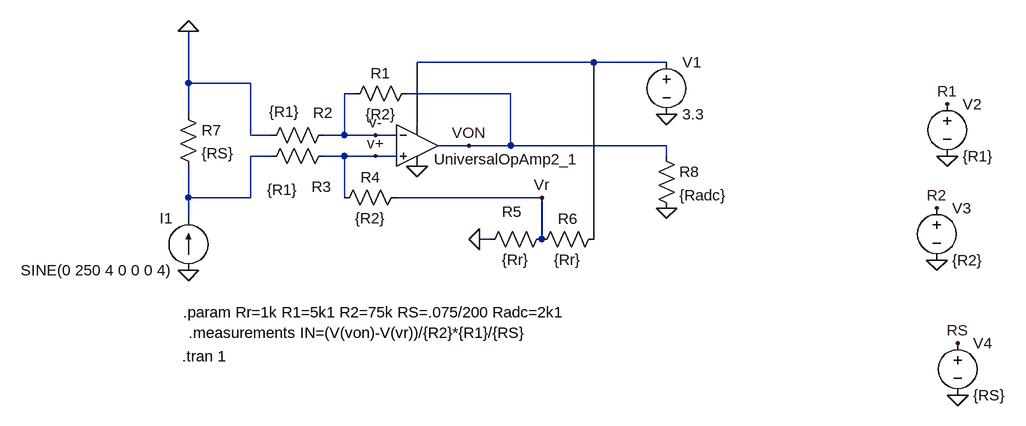
[diagram p0: schematic ib_filter_module.asc]
ib_filter_module.asc, the LTspice schematic file:
Version 4
SHEET 1 1480 704
WIRE 432 16 160 16
WIRE 544 16 432 16
WIRE -192 48 -192 -32
WIRE -96 48 -192 48
WIRE 64 64 48 64
WIRE 304 64 144 64
WIRE -192 96 -192 48
WIRE 160 112 160 16
WIRE -96 128 -96 48
WIRE -64 128 -96 128
WIRE 48 128 48 64
WIRE 48 128 16 128
WIRE 96 128 48 128
WIRE 128 128 96 128
WIRE 240 144 192 144
WIRE 304 144 304 64
WIRE 304 144 240 144
WIRE 544 144 304 144
WIRE -64 160 -96 160
WIRE 48 160 16 160
WIRE 96 160 48 160
WIRE 128 160 96 160
WIRE 544 160 544 144
WIRE -192 224 -192 176
WIRE -96 224 -96 160
WIRE -96 224 -192 224
WIRE 48 224 48 160
WIRE 352 224 128 224
WIRE -192 256 -192 224
WIRE 272 288 256 288
WIRE 352 288 352 224
WIRE 432 288 432 16
FLAG 160 176 0
FLAG 544 96 0
FLAG 256 288 0
FLAG -192 336 0
FLAG 96 128 v-
FLAG 96 160 v+
FLAG 240 144 VON
FLAG 544 240 0
FLAG 352 224 Vr
FLAG 976 160 0
FLAG 960 320 0
FLAG 992 528 0
FLAG 976 80 R1
FLAG 960 240 R2
FLAG 992 448 RS
FLAG -192 -32 0
SYMBOL voltage 544 0 R0
WINDOW 123 0 0 Left 0
WINDOW 39 0 0 Left 0
SYMATTR InstName V1
SYMATTR Value 3.3
SYMBOL res 160 48 R90
WINDOW 0 0 56 VBottom 2
WINDOW 3 32 56 VTop 2
SYMATTR InstName R1
SYMATTR Value {R2}
SYMBOL res 32 112 R90
WINDOW 0 -3 17 VBottom 2
WINDOW 3 -36 76 VTop 2
SYMATTR InstName R2
SYMATTR Value {R1}
SYMBOL res 32 144 R90
WINDOW 0 79 19 VBottom 2
WINDOW 3 52 79 VTop 2
SYMATTR InstName R3
SYMATTR Value {R1}
SYMBOL res 144 208 R90
WINDOW 0 0 56 VBottom 2
WINDOW 3 32 56 VTop 2
SYMATTR InstName R4
SYMATTR Value {R2}
SYMBOL res 368 272 R90
WINDOW 0 -11 62 VBottom 2
WINDOW 3 32 56 VTop 2
SYMATTR InstName R5
SYMATTR Value {Rr}
SYMBOL res 448 272 R90
WINDOW 0 0 56 VBottom 2
WINDOW 3 32 56 VTop 2
SYMATTR InstName R6
SYMATTR Value {Rr}
SYMBOL res -208 80 R0
SYMATTR InstName R7
SYMATTR Value {RS}
SYMBOL current -192 336 R180
WINDOW 0 24 80 Left 2
WINDOW 3 24 0 Left 2
WINDOW 123 0 0 Left 0
WINDOW 39 0 0 Left 0
SYMATTR InstName I1
SYMATTR Value SINE(0 250 4 0 0 0 4)
SYMBOL res 528 144 R0
SYMATTR InstName R8
SYMATTR Value {Radc}
SYMBOL OpAmps\\UniversalOpamp2 160 144 R0
WINDOW 0 26 21 Left 2
SYMATTR InstName UniversalOpAmp2_1
SYMBOL voltage 976 64 R0
WINDOW 123 0 0 Left 0
WINDOW 39 0 0 Left 0
SYMATTR InstName V2
SYMATTR Value {R1}
SYMBOL voltage 960 224 R0
WINDOW 123 0 0 Left 0
WINDOW 39 0 0 Left 0
SYMATTR InstName V3
SYMATTR Value {R2}
SYMBOL voltage 992 432 R0
WINDOW 123 0 0 Left 0
WINDOW 39 0 0 Left 0
SYMATTR InstName V4
SYMATTR Value {RS}
TEXT -200 400 Left 2 !.param Rr=1k R1=5k1 R2=75k RS=.075/200 Radc=2k1
TEXT -202 468 Left 2 !.tran 1
TEXT -192 432 Left 2 !.measurements IN=(V(von)-V(vr))/{R2}*{R1}/{RS}

The netlist it stands for:
* ib_filter_module.asc
V1 N001 0 3.3
R1 VON v- {R2}
R2 v- 0 {R1}
R3 v+ N002 {R1}
R4 Vr v+ {R2}
R5 Vr 0 {Rr}
R6 N001 Vr {Rr}
R7 0 N002 {RS}
I1 0 N002 SINE(0 250 4 0 0 0 4)
R8 VON 0 {Radc}
XUniversalOpAmp2_1 v+ v- N001 0 VON level.2 Avol=1Meg GBW=10Meg Slew=10Meg ilimit=25m rail=0 Vos=0 phimargin=45 en=0 enk=0 in=0 ink=0 Rin=500Meg  ; pins IN+ IN- V+ V- OUT
V2 R1 0 {R1}
V3 R2 0 {R2}
V4 RS 0 {RS}
.param Rr=1k R1=5k1 R2=75k RS=.075/200 Radc=2k1
.tran 1
.measurements IN=(V(von)-V(vr))/{R2}*{R1}/{RS}
.lib UniversalOpamps2.sub
.backanno
.end